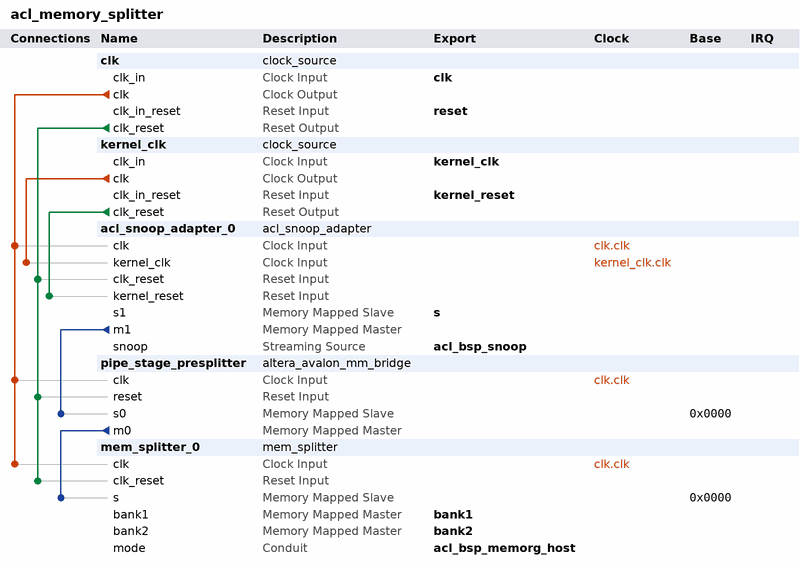
[diagram p0: system contents]
# Platform Designer (Qsys) system acl_memory_splitter, Stratix V Unknown
# Parameters at their usual value, and those the tool derives, are not listed.
package require -exact qsys 13.1
create_system acl_memory_splitter
set_project_property DEVICE_FAMILY {Stratix V}
set_project_property DEVICE Unknown

add_instance clk clock_source 13.1
set_instance_parameter_value clk clockFrequency 100000000
set_instance_parameter_value clk resetSynchronousEdges DEASSERT

add_instance kernel_clk clock_source 13.1
set_instance_parameter_value kernel_clk clockFrequency 100000000

add_instance acl_snoop_adapter_0 acl_snoop_adapter 11.0
set_instance_parameter_value acl_snoop_adapter_0 NUM_BYTES 64
set_instance_parameter_value acl_snoop_adapter_0 BYTE_ADDRESS_WIDTH 47
set_instance_parameter_value acl_snoop_adapter_0 PENDING_READS 64
set_instance_parameter_value acl_snoop_adapter_0 BURSTCOUNT_WIDTH 5

add_instance pipe_stage_presplitter altera_avalon_mm_bridge 13.1
set_instance_parameter_value pipe_stage_presplitter DATA_WIDTH 512
set_instance_parameter_value pipe_stage_presplitter ADDRESS_WIDTH 47
set_instance_parameter_value pipe_stage_presplitter ADDRESS_UNITS SYMBOLS
set_instance_parameter_value pipe_stage_presplitter MAX_BURST_SIZE 16
set_instance_parameter_value pipe_stage_presplitter MAX_PENDING_RESPONSES 64

add_instance mem_splitter_0 mem_splitter 10.0
set_instance_parameter_value mem_splitter_0 NUM_BANKS 4
set_instance_parameter_value mem_splitter_0 WIDTH_D 256
set_instance_parameter_value mem_splitter_0 M_WIDTH_A 31
set_instance_parameter_value mem_splitter_0 BURSTCOUNT_WIDTH 5
set_instance_parameter_value mem_splitter_0 MAX_PENDING_READS 64

# connections
add_connection clk.clk acl_snoop_adapter_0.clk clock
add_connection clk.clk mem_splitter_0.clk clock
add_connection clk.clk pipe_stage_presplitter.clk clock
add_connection kernel_clk.clk acl_snoop_adapter_0.kernel_clk clock
add_connection clk.clk_reset acl_snoop_adapter_0.clk_reset reset
add_connection clk.clk_reset mem_splitter_0.clk_reset reset
add_connection clk.clk_reset pipe_stage_presplitter.reset reset
add_connection kernel_clk.clk_reset acl_snoop_adapter_0.kernel_reset reset
add_connection acl_snoop_adapter_0.m1 pipe_stage_presplitter.s0 avalon
set_connection_parameter_value acl_snoop_adapter_0.m1/pipe_stage_presplitter.s0 baseAddress 0x0000
add_connection pipe_stage_presplitter.m0 mem_splitter_0.s avalon
set_connection_parameter_value pipe_stage_presplitter.m0/mem_splitter_0.s baseAddress 0x0000

# exported interfaces
add_interface acl_bsp_snoop avalon_streaming source
set_interface_property acl_bsp_snoop EXPORT_OF acl_snoop_adapter_0.snoop
add_interface clk clock sink
set_interface_property clk EXPORT_OF clk.clk_in
add_interface reset reset sink
set_interface_property reset EXPORT_OF clk.clk_in_reset
add_interface kernel_clk clock sink
set_interface_property kernel_clk EXPORT_OF kernel_clk.clk_in
add_interface kernel_reset reset sink
set_interface_property kernel_reset EXPORT_OF kernel_clk.clk_in_reset
add_interface s avalon slave
set_interface_property s EXPORT_OF acl_snoop_adapter_0.s1
add_interface acl_bsp_memorg_host conduit end
set_interface_property acl_bsp_memorg_host EXPORT_OF mem_splitter_0.mode
add_interface bank1 avalon master
set_interface_property bank1 EXPORT_OF mem_splitter_0.bank1
add_interface bank2 avalon master
set_interface_property bank2 EXPORT_OF mem_splitter_0.bank2

set_interconnect_requirement {$system} qsys_mm.clockCrossingAdapter HANDSHAKE
set_interconnect_requirement {$system} qsys_mm.maxAdditionalLatency 2

save_system acl_memory_splitter.qsys
